# Altium schematic sheet Sheet2.SchDoc: EM411-PROJ001
size A3; Date: March-25-2021; DrawnBy: Gaurav Daura; SheetNumber: 2; SheetTotal: 3
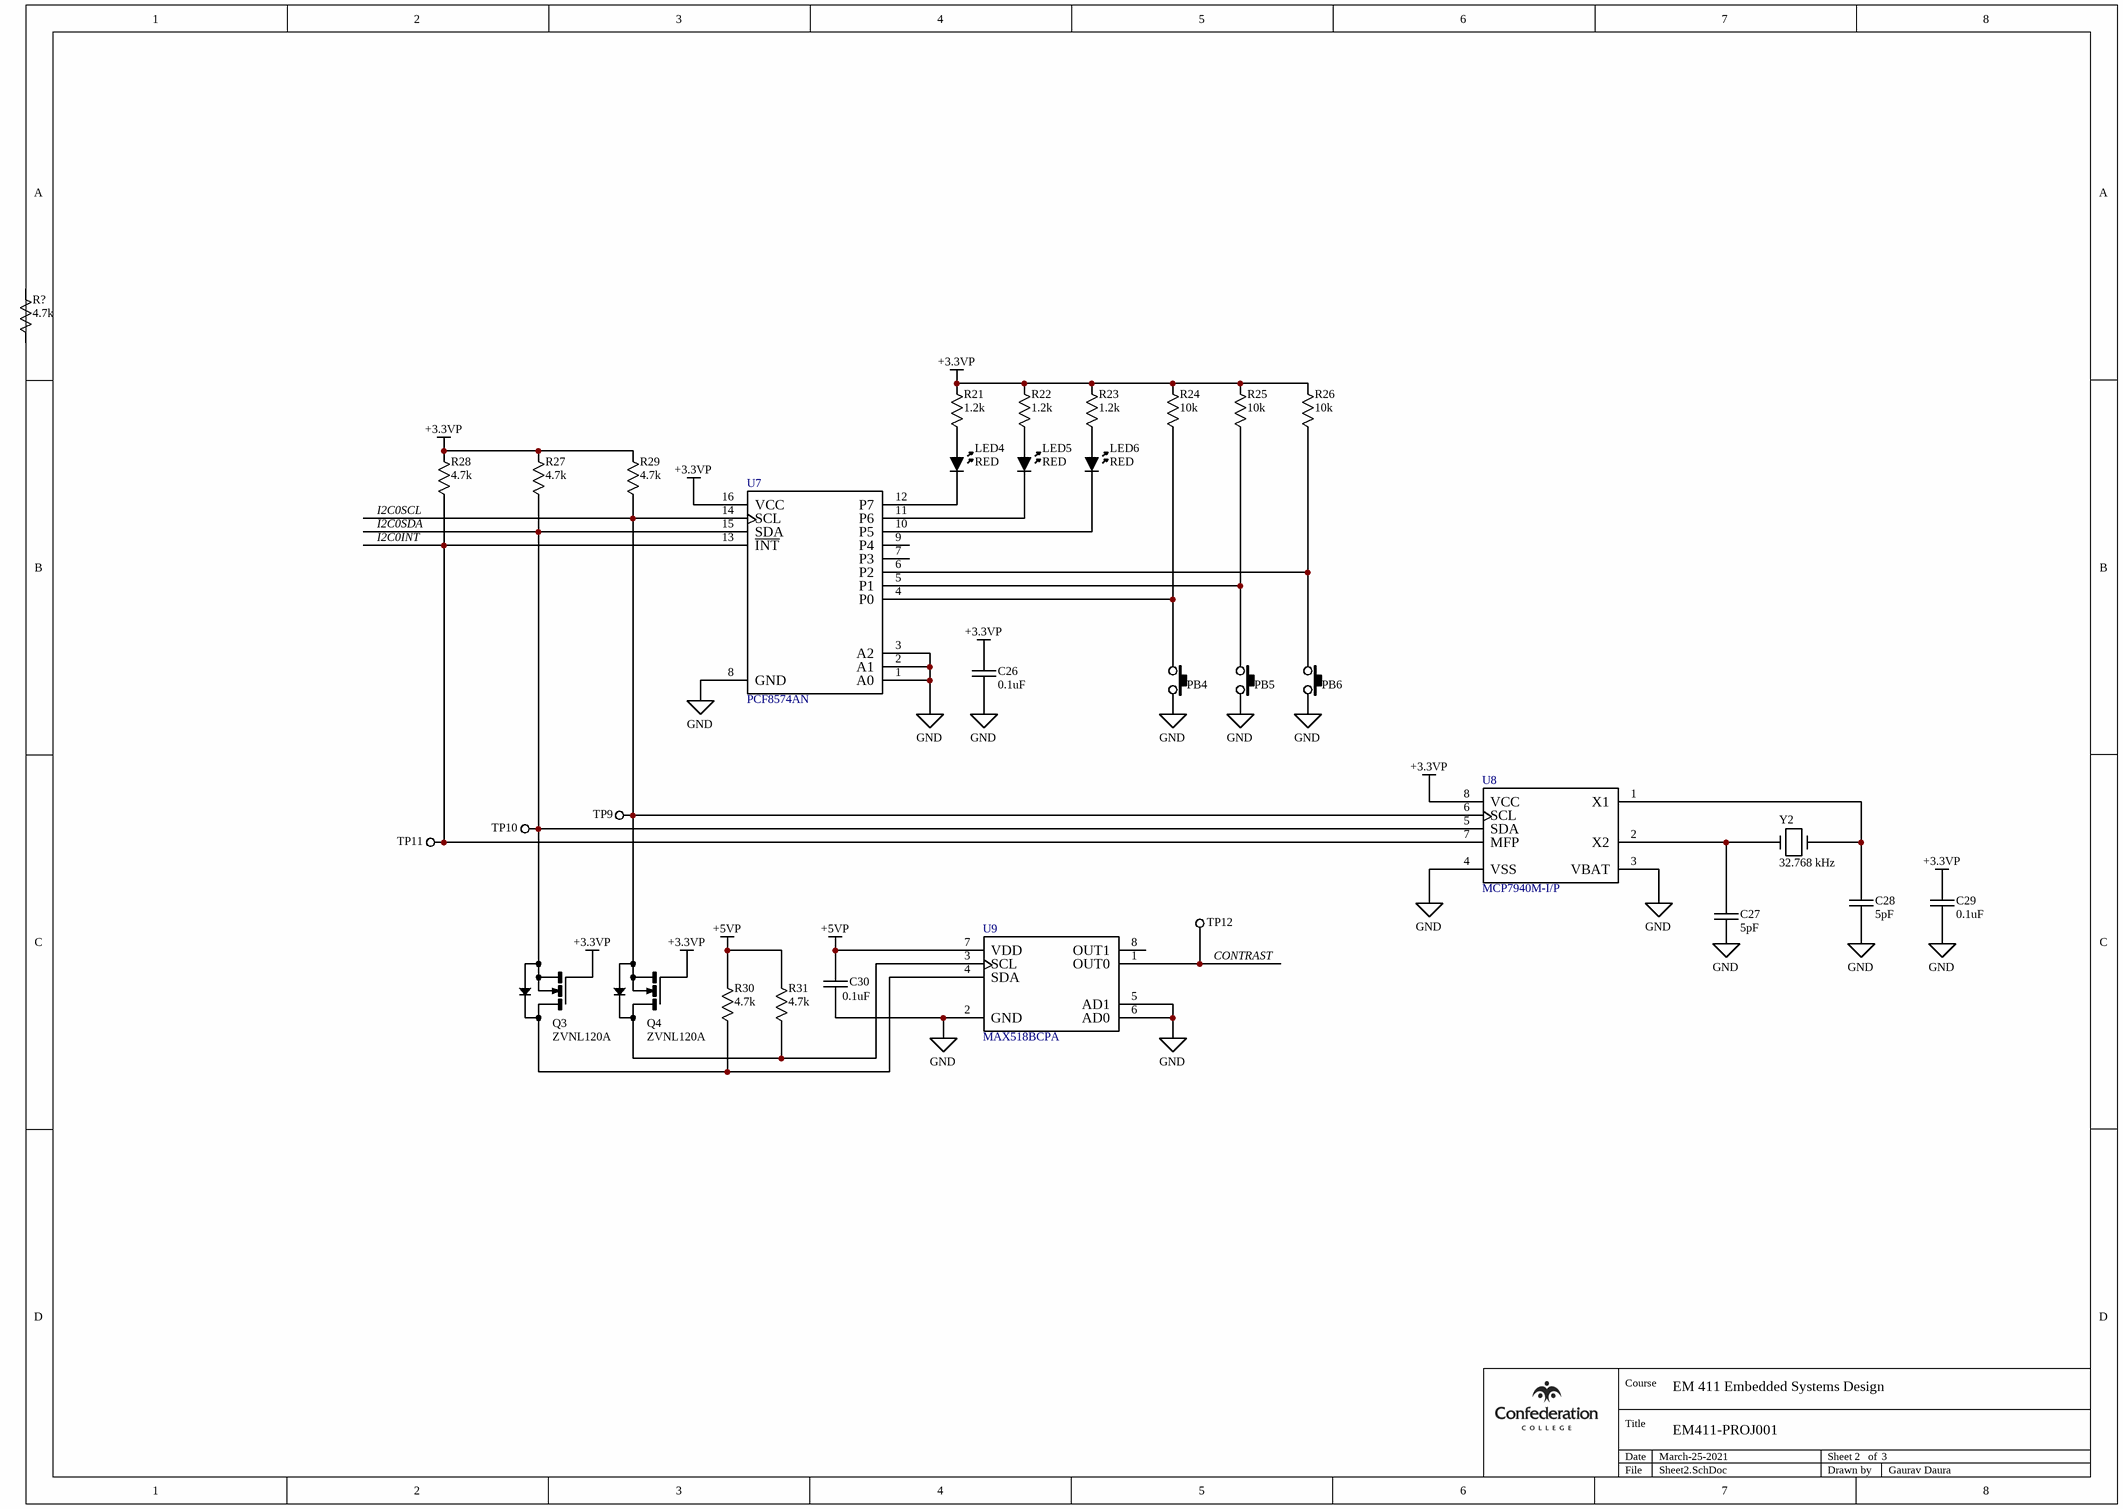
[diagram p0: Sheet2.SchDoc]

## Parts
C26  0.1uF  [C320C104M5R5TA]
C27  5pF  [RCE5C1H5R0C0M1H03A]
C28  5pF  [RCE5C1H5R0C0M1H03A]
C29  0.1uF  [C320C104M5R5TA]
C30  0.1uF  [C320C104M5R5TA]
LED4  RED  [C503B-RCN-CW0Z0AA1]
LED5  RED  [C503B-RCN-CW0Z0AA1]
LED6  RED  [C503B-RCN-CW0Z0AA1]
PB4  3-1825910-5  [3-1825910-5]  (value not drawn)
PB5  3-1825910-5  [3-1825910-5]  (value not drawn)
PB6  3-1825910-5  [3-1825910-5]  (value not drawn)
Q3  ZVNL120A  [ZVNL120A]
Q4  ZVNL120A  [ZVNL120A]
R21  1.2k  [1/2WattResistor]
R22  1.2k  [1/2WattResistor]
R23  1.2k  [1/2WattResistor]
R24  10k  [1/2WattResistor]
R25  10k  [1/2WattResistor]
R26  10k  [1/2WattResistor]
R27  4.7k  [1/2WattResistor]
R28  4.7k  [1/2WattResistor]
R29  4.7k  [1/2WattResistor]
R30  4.7k  [1/2WattResistor]
R31  4.7k  [1/2WattResistor]
R?  4.7k  [1/2WattResistor]
TP9  TESTPOINT-2MM  [TESTPOINT-2MM]  (value not drawn)  (no BOM)
TP10  TESTPOINT-2MM  [TESTPOINT-2MM]  (value not drawn)  (no BOM)
TP11  TESTPOINT-2MM  [TESTPOINT-2MM]  (value not drawn)  (no BOM)
TP12  TESTPOINT-2MM  [TESTPOINT-2MM]  (value not drawn)  (no BOM)
U7  PCF8574AN  [PCF8574AN]
U8  MCP7940M-I/P  [MCP7940M-I/P]
U9  MAX518BCPA  [MAX518BCPA]
Y2  32.768 kHz  [CFS-20632768EZBB]

## Nets
+3.3VP: C26.1 C29.1 Q3.2 Q4.2 R21.2 R22.2 R23.2 R24.2 R25.2 R26.2 R27.2 R28.2 R29.2 U7.16(VCC) U8.8(VCC)
+5VP: C30.2 R30.2 R31.2 U9.7(VDD)
GND: C26.2 C27.2 C28.2 C29.2 C30.1 PB4.2 PB5.2 PB6.2 U7.1(A0) U7.2(A1) U7.3(A2) U7.8(GND) U8.3(VBAT) U8.4(VSS) U9.2(GND) U9.5(AD1) U9.6(AD0)
CONTRAST: TP12.1 U9.1(OUT0)
I2C0INT: R28.1 TP11.1 U7.13(~{INT}) U8.7(MFP)
I2C0SCL: Q4.1 R29.1 TP9.1 U7.14(SCL) U8.6(SCL)
I2C0SDA: Q3.1 R27.1 TP10.1 U7.15(SDA) U8.5(SDA)
NetC27_1: C27.1 U8.2(X2) Y2.2
NetC28_1: C28.1 U8.1(X1) Y2.1
NetLED4_A: LED4.A R21.1
NetLED4_K: LED4.K U7.12(P7)
NetLED5_A: LED5.A R22.1
NetLED5_K: LED5.K U7.11(P6)
NetLED6_A: LED6.A R23.1
NetLED6_K: LED6.K U7.10(P5)
NetPB4_1: PB4.1 R24.1 U7.4(P0)
NetPB5_1: PB5.1 R25.1 U7.5(P1)
NetPB6_1: PB6.1 R26.1 U7.6(P2)
NetQ3_3: Q3.3 R30.1 U9.4(SDA)
NetQ4_3: Q4.3 R31.1 U9.3(SCL)

Not connected (* = marked no-connect by the designer): R? 1 2; U7 7(P3) 9(P4); U9 8(OUT1)

## Notes on the sheet
- Course
- EM 411 Embedded Systems Design
- Title
- Date
- Sheet
- of
- File
- Drawn by

## Library data of the parts
C26 C29 C30 = C320C104M5R5TA: 0.1 uF, 50 V Ceramic Capacitor; Manufacturer: Kemet; PartNumber: C320C104M5R5TA
C27 C28 = RCE5C1H5R0C0M1H03A: 5 pF, 50 V Ceramic Capacitor; Manufacturer: Murata Electronics North America; PartNumber: RCE5C1H5R0C0M1H03A
LED4-LED6 = C503B-RCN-CW0Z0AA1: 5 mm Red Round LED; Manufacturer: Cree, Inc.; PartNumber: C503B-RCN-CW0Z0AA1; Value: RED
PB4-PB6 = 3-1825910-5: SWITCH TACTILE SPST-NO 0.05A 24V; Manufacturer: TE Connectivity ALCOSWITCH Switches; PartNumber: 3-1825910-5
Q3 Q4 = ZVNL120A: 25V, 31 A, N-Channel Power MOSFET; Manufacturer: Diodes Inc; PartNumber: ZVNL120A
R21-R23 = RES1k2-500mW-THRU-HOLE: 1.2k, ±5%, 0.5W Thru-Hole Resistor; Manufacturer: Generic; PartNumber: RES1k2-500mW-THRU-HOLE; Value: 1.2k
R24-R26 = RES10k-500mW-THRU-HOLE: 10k, ±5%, 0.5W Thru-Hole Resistor; Manufacturer: Generic; PartNumber: RES10k-500mW-THRU-HOLE; Value: 10k
R27-R31 R? = RES4k7-500mW-THRU-HOLE: 4.7 kOhm, ±5%, 0.5W Thru-Hole Resistor; Manufacturer: Generic; PartNumber: RES4k7-500mW-THRU-HOLE; Value: 4.7k
TP9-TP12 = TESTPOINT-2MM: Test Point 2MM diameter; Manufacturer: -; PartNumber: -
U7 = PCF8574AN: Remote 8-Bit I/O Expander for I2C Bus; Manufacturer: Texas Instruments Inc.; PartNumber: PCF8574AN
U8 = MCP7940M-I/P: Clock and Calendar with 64-Byte SRAM; Manufacturer: Microchip Technology; PartNumber: MCP7940M-I/P
U9 = MAX518BCPA: 2-Wire Serial 8-Bit DACs with Rail-to-Rail Outputs; Manufacturer: Maxim Integrated Products; PartNumber: MAX518BCPA
Y2 = CFS-20632768EZBB: 32.768 kHz Tuning Fork (Cylinder Type, 6 pF); Manufacturer: Citizen; PartNumber: CFS-20632768EZBB